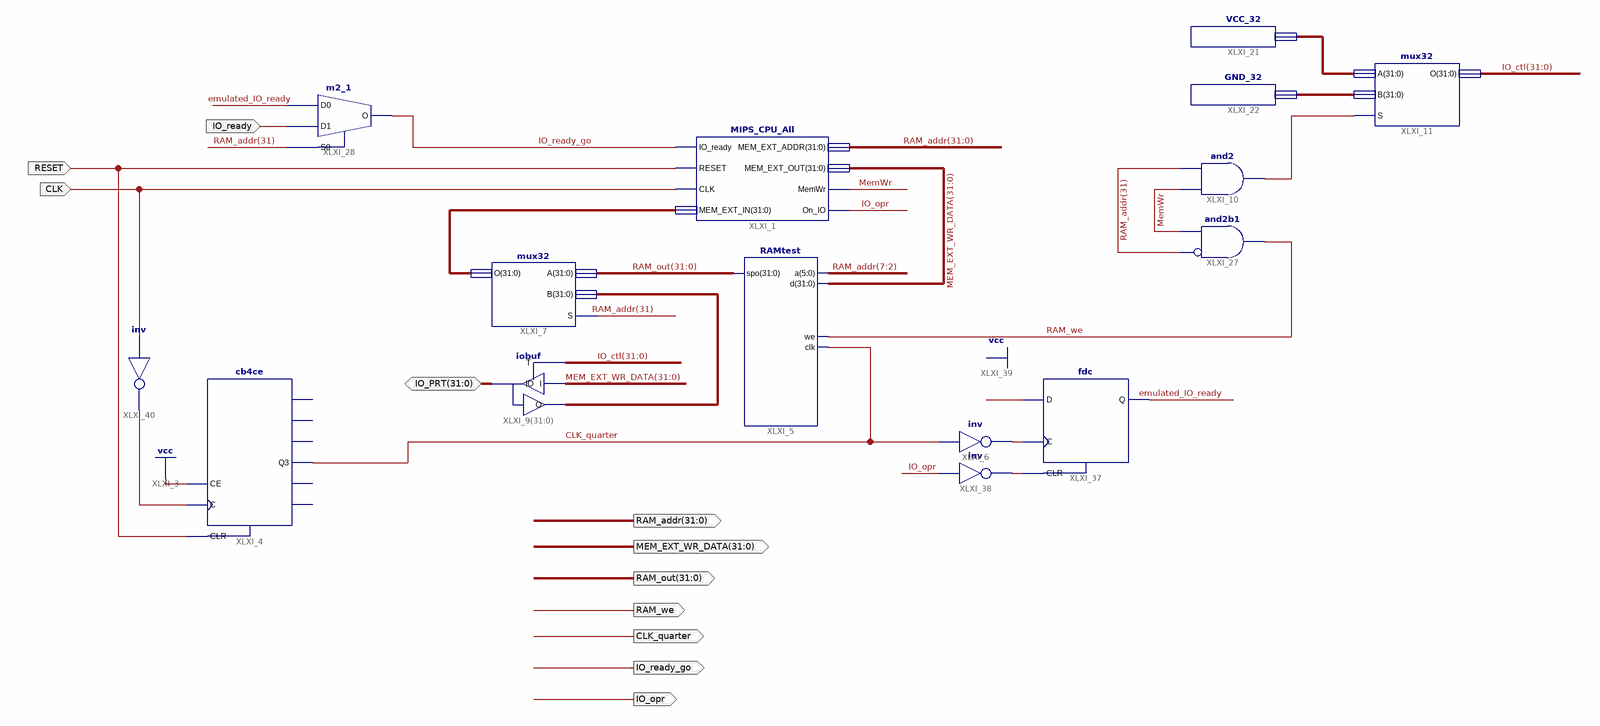
[diagram p0: schematic sheet 1]
// Xilinx ISE schematic CPU_Testor.sch (spartan6) as structural Verilog: 15 symbols, 12 ports
module CPU_Testor (
  input  RESET,
  input  CLK,
  input  IO_ready,
  inout  [31:0] IO_PRT,
  output [31:0] MEM_EXT_WR_DATA,
  output [31:0] RAM_addr,
  output CLK_quarter,
  output RAM_we,
  output IO_opr,
  output [31:0] RAM_out,
  output IO_ready_go
);

  wire emulated_IO_ready, MemWr, XLXN_30, XLXN_111, XLXN_113, XLXN_115;
  wire [31:0] IO_ctl, XLXN_27, XLXN_51, XLXN_54, XLXN_85;

  MIPS_CPU_All XLXI_1 (
    .CLK(CLK), .IO_ready(IO_ready_go), .MemWr(MemWr), .MEM_EXT_ADDR(RAM_addr), .MEM_EXT_IN(XLXN_85),
    .MEM_EXT_OUT(MEM_EXT_WR_DATA), .On_IO(IO_opr), .RESET(RESET));
  RAMtest XLXI_5 (.a(RAM_addr[7:2]), .d(MEM_EXT_WR_DATA), .we(RAM_we), .clk(CLK_quarter), .spo(RAM_out));
  mux32 XLXI_7 (.A(RAM_out), .B(XLXN_27), .S(RAM_addr[31]), .O(XLXN_85));
  iobuf XLXI_9[31:0] (.I(MEM_EXT_WR_DATA), .IO(IO_PRT), .O(XLXN_27), .T(IO_ctl));
  mux32 XLXI_11 (.A(XLXN_51), .B(XLXN_54), .S(XLXN_30), .O(IO_ctl));
  VCC_32 XLXI_21 (.VCC_OUT(XLXN_51));
  GND_32 XLXI_22 (.GND_OUT(XLXN_54));
  cb4ce XLXI_4 (.C(XLXN_115), .CE(1'b1), .CLR(RESET), .Q3(CLK_quarter));  // open: CEO, Q0, Q1, Q2, TC
  not XLXI_6 (XLXN_113, CLK_quarter);
  m2_1 XLXI_28 (.D0(emulated_IO_ready), .D1(IO_ready), .S0(RAM_addr[31]), .O(IO_ready_go));
  and XLXI_27 (RAM_we, ~RAM_addr[31], MemWr);  // and2b1
  and XLXI_10 (XLXN_30, MemWr, RAM_addr[31]);
  fdc XLXI_37 (.C(XLXN_113), .CLR(XLXN_111), .D(1'b1), .Q(emulated_IO_ready));
  not XLXI_38 (XLXN_111, IO_opr);
  not XLXI_40 (XLXN_115, CLK);
endmodule
